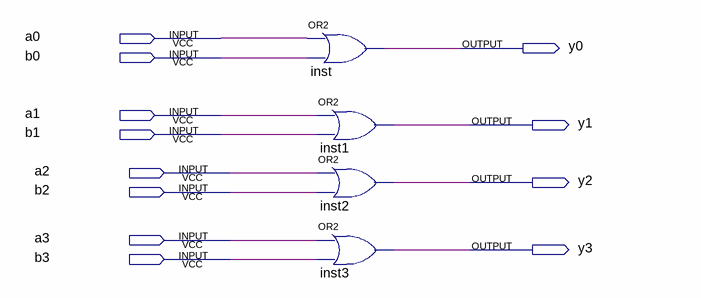
[diagram p0: schematic sheet]
// Quartus schematic orProject.bdf as structural Verilog: 4 symbols, 12 pins
module orProject (
  input  a0,
  input  b0,
  input  a1,
  input  b1,
  input  a2,
  input  b2,
  input  a3,
  input  b3,
  output y0,
  output y1,
  output y2,
  output y3
);

  or inst (y0, a0, b0);
  or inst1 (y1, a1, b1);
  or inst2 (y2, a2, b2);
  or inst3 (y3, a3, b3);
endmodule
